# EAGLE schematic eCog115_PS2 (EAGLE 6.6.0)
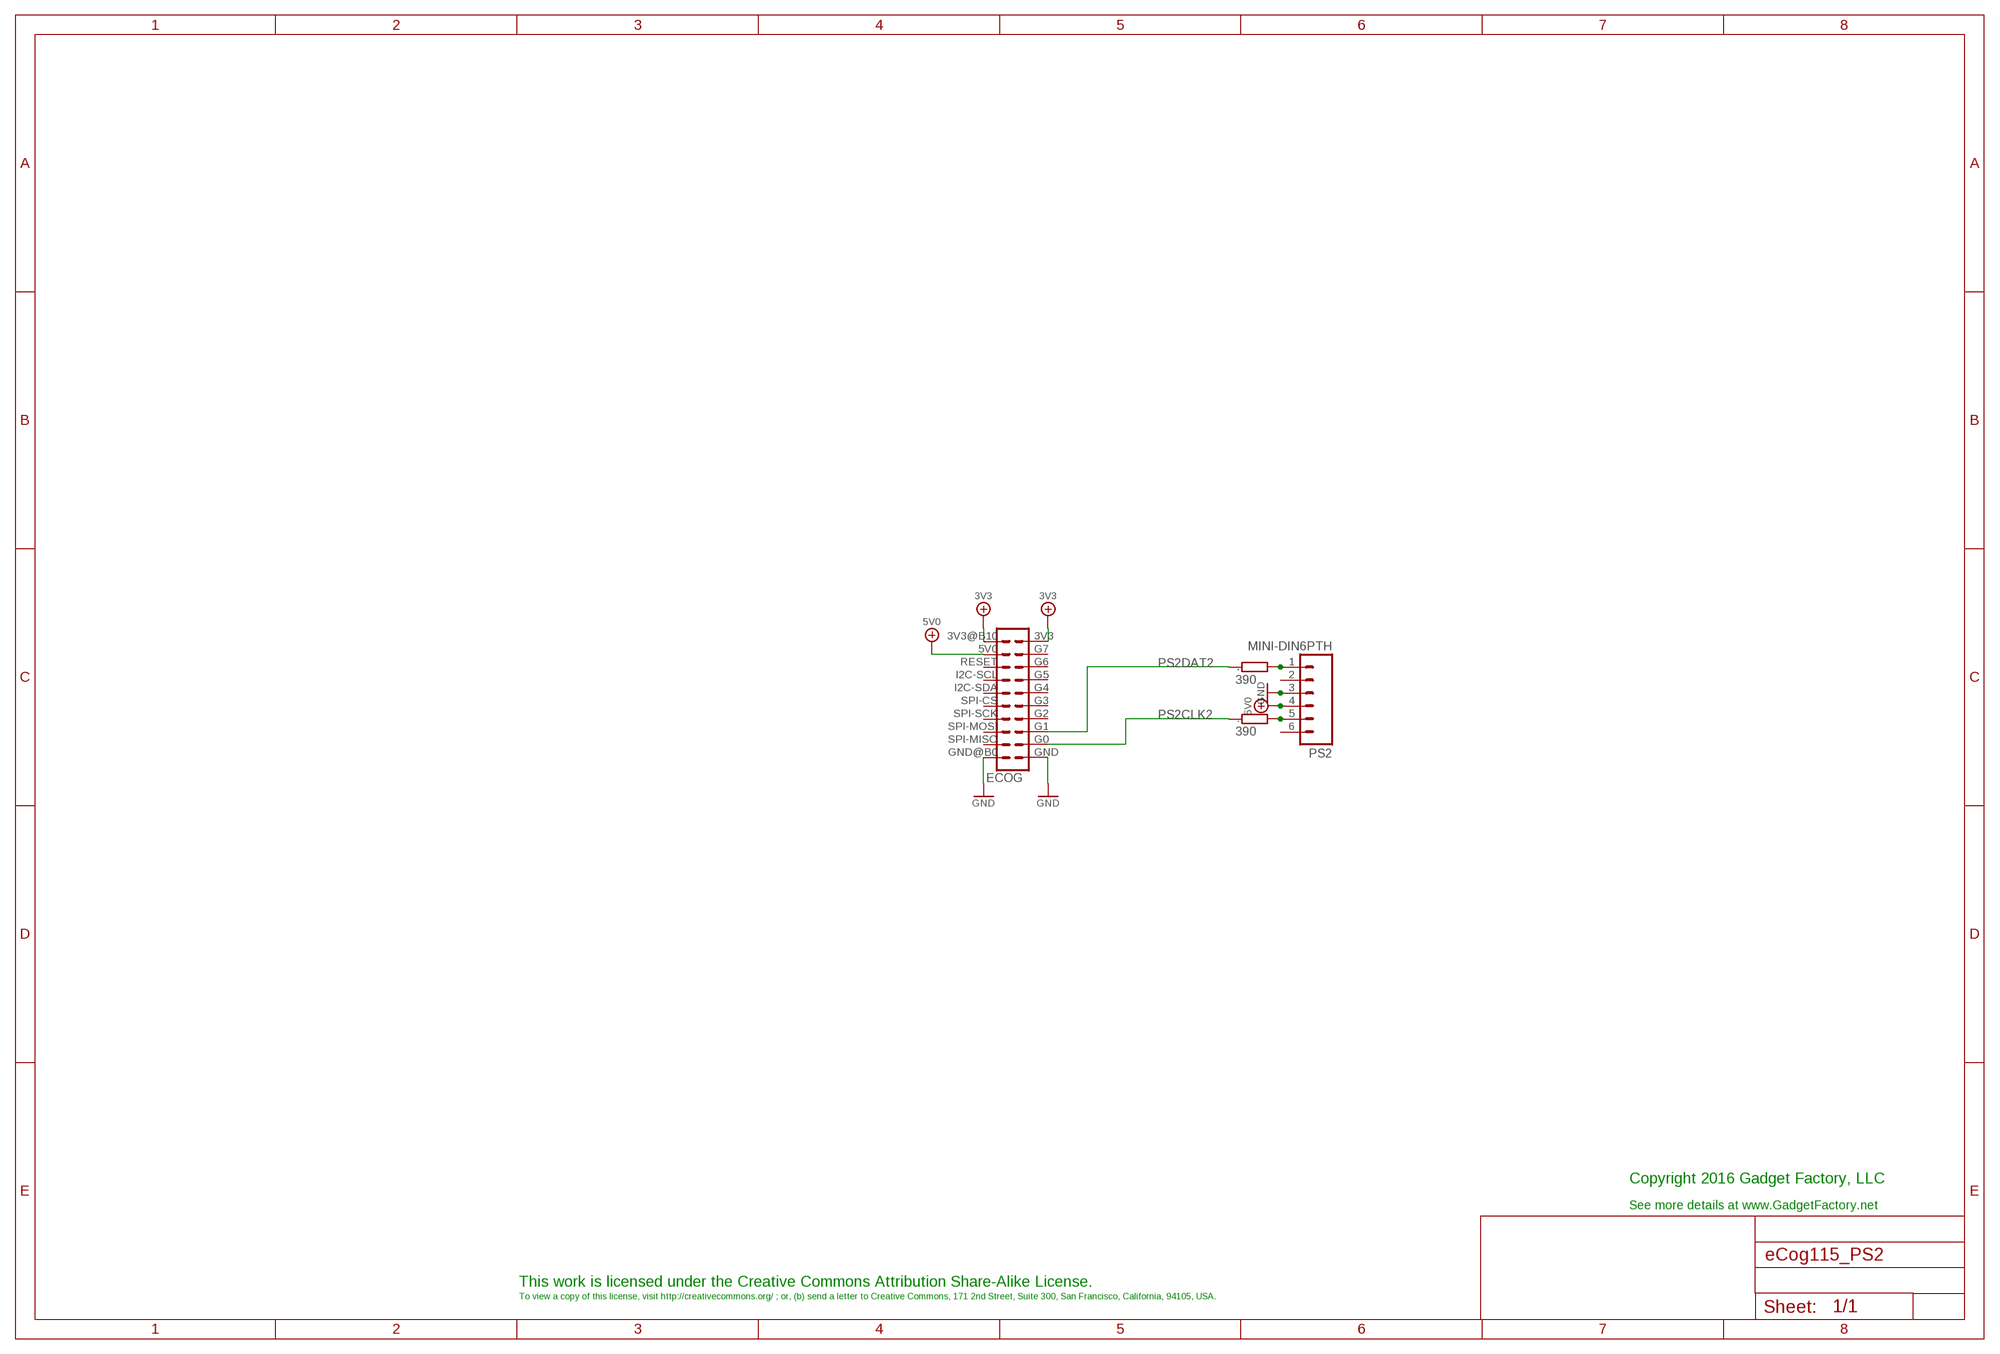
[diagram p0: schematic, sheet 1]

## Parts
ECOG  ECOG_DUALTHROUGHHOLE  [ECOG_DUAL_TH]
PS2  MINI-DIN6PTH  [MINI-DIN6]
R1  390  R0603  [0603]
R2  390  R0603  [0603]

## Nets
3V3: ECOG.3V3 ECOG.3V3@B10(3V3)
5V0: ECOG.5V0(5V) PS2.4
GND: ECOG.GND ECOG.GND@B0(GND) PS2.3
N$14: PS2.1 R1.2
N$15: PS2.5 R2.2
PS2CLK2: ECOG.G0 R2.1
PS2DAT2: ECOG.G1 R1.1
Unconnected: ECOG.G2 ECOG.G3 ECOG.G4 ECOG.G5 ECOG.G6 ECOG.G7 ECOG.I2C-SCL ECOG.I2C-SDA ECOG.RESET ECOG.SPI-CS ECOG.SPI-MISO ECOG.SPI-MOSI ECOG.SPI-SCK PS2.2 PS2.6

## Notes on the sheet
- Copyright 2016 Gadget Factory, LLC
- See more details at www.GadgetFactory.net
- This work is licensed under the Creative Commons Attribution Share-Alike License.
- To view a copy of this license, visit http://creativecommons.org/ ; or, (b) send a letter to Creative Commons, 171 2nd Street, Suite 300, San Francisco, California, 94105, USA.

## Library data of the parts
ECOG = eCogs:ECOG_DUAL
PS2 = SparkFun-Connectors:MINI-DIN6: mini DIN 6 Connector Commonly found on the back of a computer for PS2 keyboard and mice. Schematic and footprint are proven. Spark Fun Electronics SKU : PRT-08509
R1 R2 = GadgetFactory:R: RESISTOR, European symbol